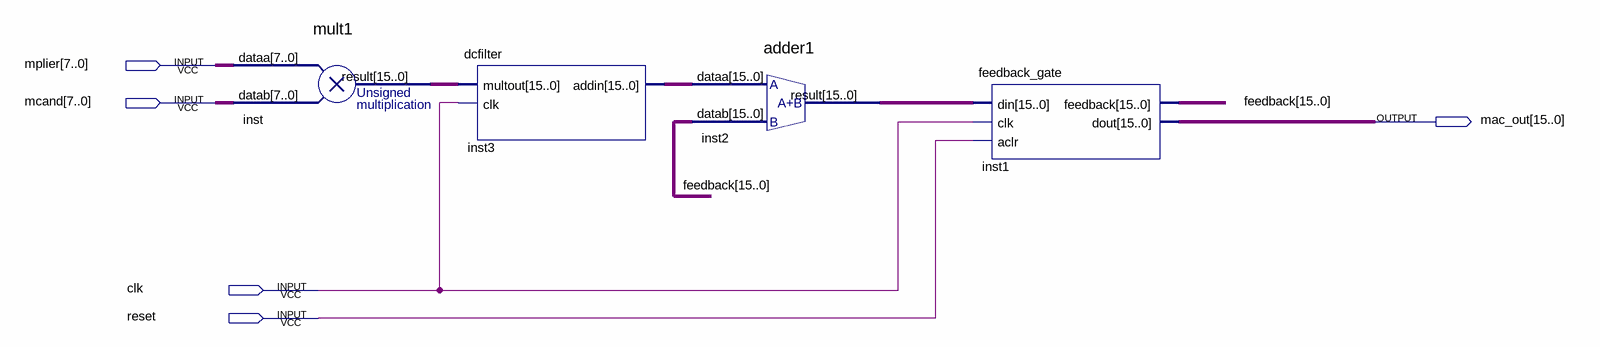
[diagram p0: schematic sheet]
// Quartus schematic mac.bdf as structural Verilog: 4 symbols, 5 pins
module mac (
  input  [7:0] mplier,
  input  [7:0] mcand,
  input  clk,
  input  reset,
  output [15:0] mac_out
);

  wire [15:0] feedback, inst2_result, inst3_addin, inst_result;

  mult1 inst (.dataa(mplier), .datab(mcand), .result(inst_result));
  dcfilter inst3 (.multout(inst_result), .clk(clk), .addin(inst3_addin));
  adder1 inst2 (.dataa(inst3_addin), .datab(feedback), .result(inst2_result));
  feedback_gate inst1 (.din(inst2_result), .clk(clk), .aclr(reset), .feedback(feedback), .dout(mac_out));
endmodule
